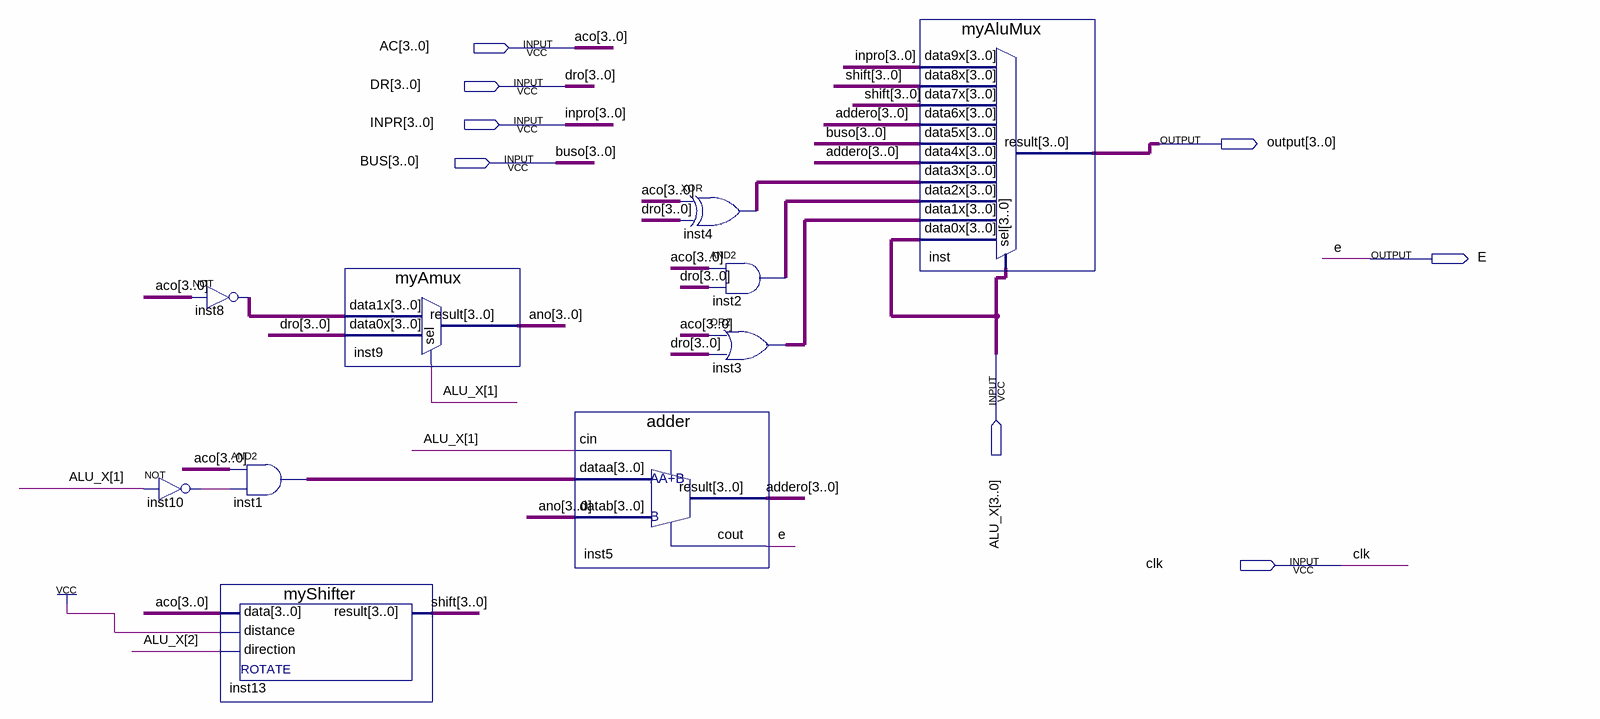
[diagram p0: schematic sheet]
// Quartus schematic alu.bdf as structural Verilog: 10 symbols, 8 pins
module alu (
  input  [3:0] AC,
  input  [3:0] DR,
  input  [3:0] INPR,
  input  [3:0] BUS,
  input  [3:0] ALU_X,
  input  clk,
  output [3:0] \output ,
  output E
);

  wire inst10_out;
  wire [3:0] addero, ano, inst1_out, inst2_out, inst3_out, inst4_out, inst8_out, shift;

  not inst10 (inst10_out, ALU_X[1]);
  assign inst8_out = ~AC;  // NOT inst8, 4 bits wide
  assign inst1_out = AC & {4{inst10_out}};  // AND2 inst1, 4 bits wide
  myShifter inst13 (.data(AC), .distance(1'b1), .direction(ALU_X[2]), .result(shift));
  myAmux inst9 (.data1x(inst8_out), .data0x(DR), .sel(ALU_X[1]), .result(ano));
  adder inst5 (.cin(ALU_X[1]), .dataa(inst1_out), .datab(ano), .result(addero), .cout(E));
  assign inst4_out = AC ^ DR;  // XOR inst4, 4 bits wide
  assign inst2_out = AC & DR;  // AND2 inst2, 4 bits wide
  assign inst3_out = AC | DR;  // OR2 inst3, 4 bits wide
  myAluMux inst (
    .data9x(INPR), .data8x(shift), .data7x(shift), .data6x(addero), .data5x(BUS), .data4x(addero),
    .data3x(inst4_out), .data2x(inst2_out), .data1x(inst3_out), .data0x(ALU_X), .sel(ALU_X), .result(\output ));

  // Other names for the same wires on the sheet: aco[3:0] = AC; buso[3:0] = BUS; dro[3:0] = DR; inpro[3:0] = INPR
endmodule
